# EAGLE design kolrs868_rx (EAGLE 6.4)
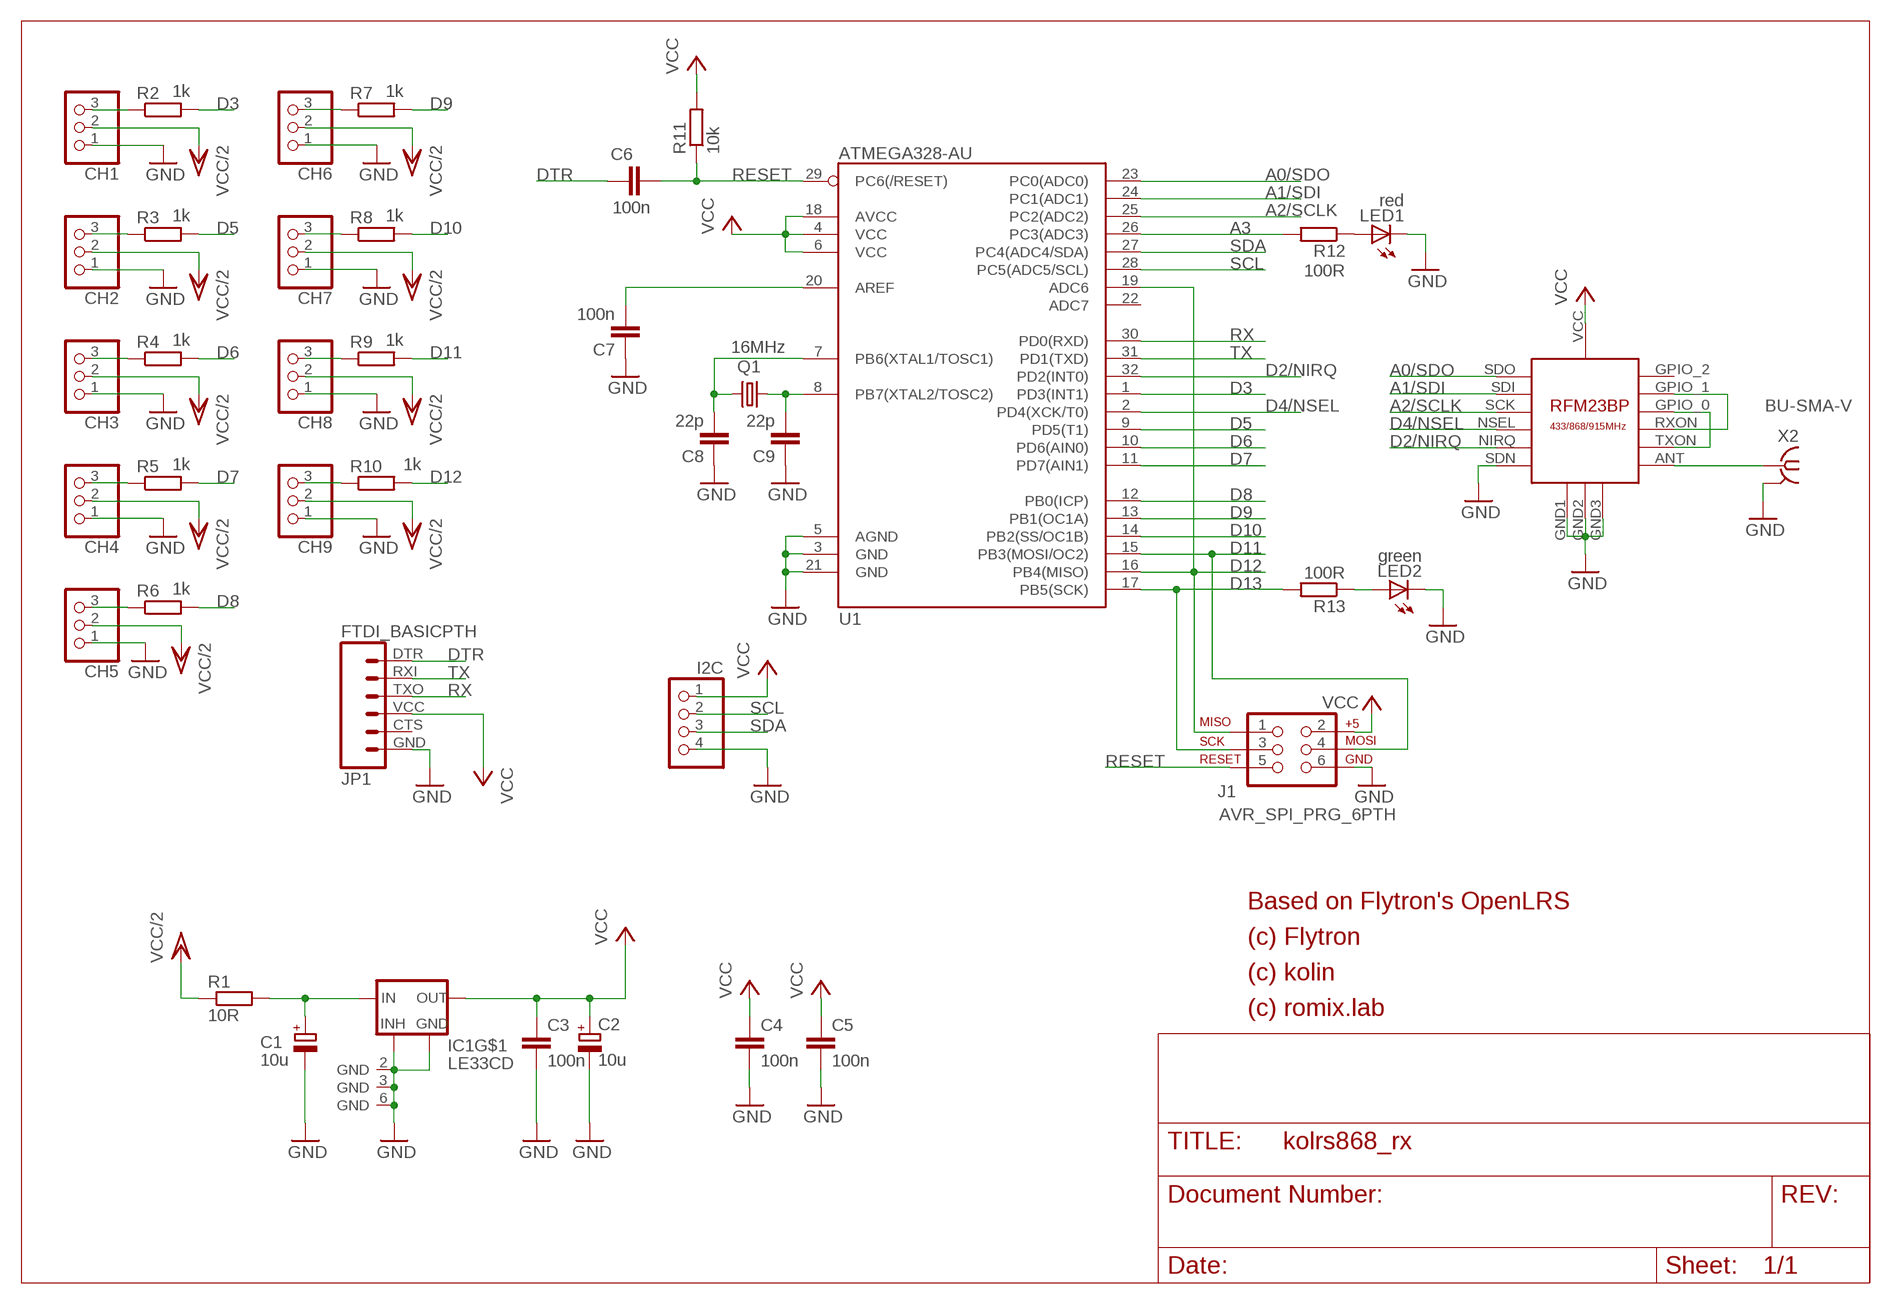
[diagram p0: schematic, sheet 1]

## Parts
C1  10u  CPOL-EUSMCB  [SMC_B]
C2  10u  CPOL-EUSMCB  [SMC_B]
C3  100n  C-EU_KOLIN  [M0805]
C4  100n  C-EU_KOLIN  [M0805]
C5  100n  C-EU_KOLIN  [M0805]
C6  100n  C-EU_KOLIN  [M0805]
C7  100n  C-EU_KOLIN  [M0805]
C8  22p  C-EU_KOLIN  [M0805]
C9  22p  C-EU_KOLIN  [M0805]
CH1  PINHD-1X3_KOLINOVO  [1X03]
CH2  PINHD-1X3_KOLINOVO  [1X03]
CH3  PINHD-1X3_KOLINOVO  [1X03]
CH4  PINHD-1X3_KOLINOVO  [1X03]
CH5  PINHD-1X3_KOLINOVO  [1X03]
CH6  PINHD-1X3_KOLINOVO  [1X03]
CH7  PINHD-1X3_KOLINOVO  [1X03]
CH8  PINHD-1X3_KOLINOVO  [1X03]
CH9  PINHD-1X3_KOLINOVO  [1X03]
I2C  PINHD-1X4  [1X04]
IC1  LE33CD  [SO8]
J1  AVR_SPI_PRG_6PTH  [2X3]
JP1  FTDI_BASICPTH  [FTDI_BASIC]
LED1  red  LEDCHIPLED_0805  [CHIPLED_0805]
LED2  green  LEDCHIPLED_0805  [CHIPLED_0805]
Q1  16MHz  CRYSTALHC49UP  [HC49UP]
R1  10R  R-EU_KOLINM0805  [M0805]
R2  1k  R-EU_KOLINM0805  [M0805]
R3  1k  R-EU_KOLINM0805  [M0805]
R4  1k  R-EU_KOLINM0805  [M0805]
R5  1k  R-EU_KOLINM0805  [M0805]
R6  1k  R-EU_KOLINM0805  [M0805]
R7  1k  R-EU_KOLINM0805  [M0805]
R8  1k  R-EU_KOLINM0805  [M0805]
R9  1k  R-EU_KOLINM0805  [M0805]
R10  1k  R-EU_KOLINM0805  [M0805]
R11  10k  R-EU_KOLINM0805  [M0805]
R12  100R  R-EU_KOLINM0805  [M0805]
R13  100R  R-EU_KOLINM0805  [M0805]
U1  ATMEGA328-AU  ATMEGA168  [TQFP32-08]
U$1  RFM23BP  [RFM23BP]
X2  BU-SMA-V  [BU-SMA-V]

## Nets
A0/SDO: U1.23(PC0(ADC0)) U$1.SDO
A1/SDI: U1.24(PC1(ADC1)) U$1.SDI
A2/SCLK: U1.25(PC2(ADC2)) U$1.SCK
A3: R12.2 U1.26(PC3(ADC3))
D2/NIRQ: U1.32(PD2(INT0)) U$1.NIRQ
D3: R2.2 U1.1(PD3(INT1))
D4/NSEL: U1.2(PD4(XCK/T0)) U$1.NSEL
D5: R3.2 U1.9(PD5(T1))
D6: R4.2 U1.10(PD6(AIN0))
D7: R5.2 U1.11(PD7(AIN1))
D8: R6.2 U1.12(PB0(ICP))
D9: R7.2 U1.13(PB1(OC1A))
D10: R8.2 U1.14(PB2(SS/OC1B))
D11: J1.4 R9.2 U1.15(PB3(MOSI/OC2))
D12: J1.1 R10.2 U1.16(PB4(MISO)) U1.19(ADC6)
D13: J1.3 R13.2 U1.17(PB5(SCK))
DTR: C6.1 JP1.DTR
GND: C1.- C2.- C3.2 C4.2 C5.2 C7.1 C8.1 C9.1 CH1.1 CH2.1 CH3.1 CH4.1 CH5.1 CH6.1 CH7.1 CH8.1 CH9.1 I2C.4 IC1.2(GND) IC1.3(GND) IC1.5(INHIBIT) IC1.6(GND) IC1.7(GND) J1.6 JP1.GND LED1.C LED2.C U1.3(GND) U1.5(AGND) U1.21(GND) U$1.GND1 U$1.GND2 U$1.GND3 U$1.SDN X2.2(GND)
N$1: C7.2 U1.20(AREF)
N$4: U$1.ANT X2.1
N$5: LED1.A R12.1
N$6: C8.2 Q1.2 U1.7(PB6(XTAL1/TOSC1))
N$7: C9.2 Q1.1 U1.8(PB7(XTAL2/TOSC2))
N$9: C1.+ IC1.8(IN) R1.2
N$11: CH5.3 R6.1
N$12: CH1.3 R2.1
N$14: CH2.3 R3.1
N$15: CH3.3 R4.1
N$16: CH4.3 R5.1
N$17: CH6.3 R7.1
N$18: CH7.3 R8.1
N$19: CH8.3 R9.1
N$20: CH9.3 R10.1
N$23: U$1.GPIO_0 U$1.TXON
N$24: U$1.GPIO_1 U$1.RXON
N$25: LED2.A R13.1
RESET: C6.2 J1.5 R11.1 U1.29(PC6(/RESET))
RX: JP1.TXO U1.30(PD0(RXD))
SCL: I2C.2 U1.28(PC5(ADC5/SCL))
SDA: I2C.3 U1.27(PC4(ADC4/SDA))
TX: JP1.RXI U1.31(PD1(TXD))
VCC: C2.+ C3.1 C4.1 C5.1 I2C.1 IC1.1(OUT) J1.2 JP1.VCC R11.2 U1.4(VCC) U1.6(VCC) U1.18(AVCC) U$1.VCC
VCC/2: CH1.2 CH2.2 CH3.2 CH4.2 CH5.2 CH6.2 CH7.2 CH8.2 CH9.2 R1.1
Unconnected: JP1.CTS U1.22(ADC7) U$1.GPIO_2

## Notes on the sheet
- Based on Flytron's OpenLRS
- (c) Flytron
- (c) kolin
- (c) romix.lab

## Power pins joined to a net without a drawn wire
GND: X2.3(GND) X2.4(GND) X2.5(GND)

## Library data of the parts
C1 C2 = rcl:CPOL-EU: POLARIZED CAPACITOR, European symbol
C3-C9 = PINHEAD_RC:C-EU_KOLIN: CAPACITOR, European symbol
CH1-CH9 = PINHEAD_RC:PINHD-1X3_KOLINOVO: KOLINOVO PIN HEADER
I2C = pinhead:PINHD-1X4: PIN HEADER
IC1 = libstabilizatory:LE33CD: VOLTAGE REGULATOR WITH INHIBIT
J1 = SparkFun:AVR_SPI_PRG_6: AVR ISP 6 Pin This is the reduced ISP connector for AVR programming. Common on Arduino. This footprint will take up less PCB space and can be used with a 10-pin to 6-pin adapter such as SKU: BOB-08508
JP1 = SparkFun:FTDI_BASIC: FTDI Basic: 3.3V and 5V
LED1 LED2 = led:LED: LED OSRAM: - CHIPLED LG R971, LG N971, LY N971, LG Q971, LY Q971, LO R971, LY R971 LH N974, LH R974 LS Q976, LO Q976, LY Q976 LO Q996 - Hyper CHIPLED LW Q18S LB Q993, LB Q99A, LB R99A - SideLED LS A670, LO A670, LY A670, LG A670, LP A670 LB A673, LV A673, LT A673, LW A673 LH A674 LY A675 LS A676, LA A676, LO A676, LY A676, LW A676 LS A679, LY A679, LG A679 - Hyper Micro SIDELED® LS Y876, LA Y876, LO Y876, LY Y876 LT Y87S - SmartLED LW L88C, LW L88S LB L89C, LB L89S, LG L890 LS L89K, LO L89K, LY L89K LS L896, LA L896, LO L896, LY L896 - TOPLED LS T670, LO T670, LY T670, LG T670, LP T670 LSG T670, LSP T670, LSY T670, LOP T670, LYG T670 LG T671, LOG T671, LSG T671 LB T673, LV T673, LT T673, LW T673 LH T674 LS T676, LA T676, LO T676, LY T676, LB T676, LH T676, LSB T676, LW T676 LB T67C, LV T67C, LT T67C, LS T67K, LO T67K, LY T67K, LW E67C LS E67B, LA E67B, LO E67B, LY E67B, LB E67C, LV E67C, LT E67C LW T67C LS T679, LY T679, LG T679 LS T770, LO T770, LY T770, LG T770, LP T770 LB T773, LV T773, LT T773, LW T773 LH T774 LS E675, LA E675, LY E675, LS T675 LS T776, LA T776, LO T776, LY T776, LB T776 LHGB T686 LT T68C, LB T68C - Hyper Mini TOPLED® LB M676 - Mini TOPLED Santana® LG M470 LS M47K, LO M47K, LY M47K Source: http://www.osram.convergy.de LUXEON: - LUMILED® LXK2-PW12-R00, LXK2-PW12-S00, LXK2-PW14-U00, LXK2-PW14-V00 LXK2-PM12-R00, LXK2-PM12-S00, LXK2-PM14-U00 LXK2-PE12-Q00, LXK2-PE12-R00, LXK2-PE12-S00, LXK2-PE14-T00, LXK2-PE14-U00 LXK2-PB12-K00, LXK2-PB12-L00, LXK2-PB12-M00, LXK2-PB14-N00, LXK2-PB14-P00, LXK2-PB14-Q00 LXK2-PR12-L00, LXK2-PR12-M00, LXK2-PR14-Q00, LXK2-PR14-R00 LXK2-PD12-Q00, LXK2-PD12-R00, LXK2-PD12-S00 LXK2-PH12-R00, LXK2-PH12-S00 LXK2-PL12-P00, LXK2-PL12-Q00, LXK2-PL12-R00 Source: www.luxeon.com KINGBRIGHT: KA-3528ASYC Source: www.kingbright.com
Q1 = crystal:CRYSTAL: CRYSTAL; OC_FARNELL: unknown; OC_NEWARK: unknown
R1-R13 = PINHEAD_RC:R-EU_KOLIN: RESISTOR, European symbol
U1 = SparkFun:ATMEGA168
U$1 = RFM23BP:RFM23BP: HopeRF RFM23BP Library by: http://projects.weber-itam.de
X2 = con-coax:BU-SMA-V: FEMALE SMA CONNECTOR Radiall distributor RS 112-3794; OC_FARNELL: unknown; OC_NEWARK: unknown

## Board
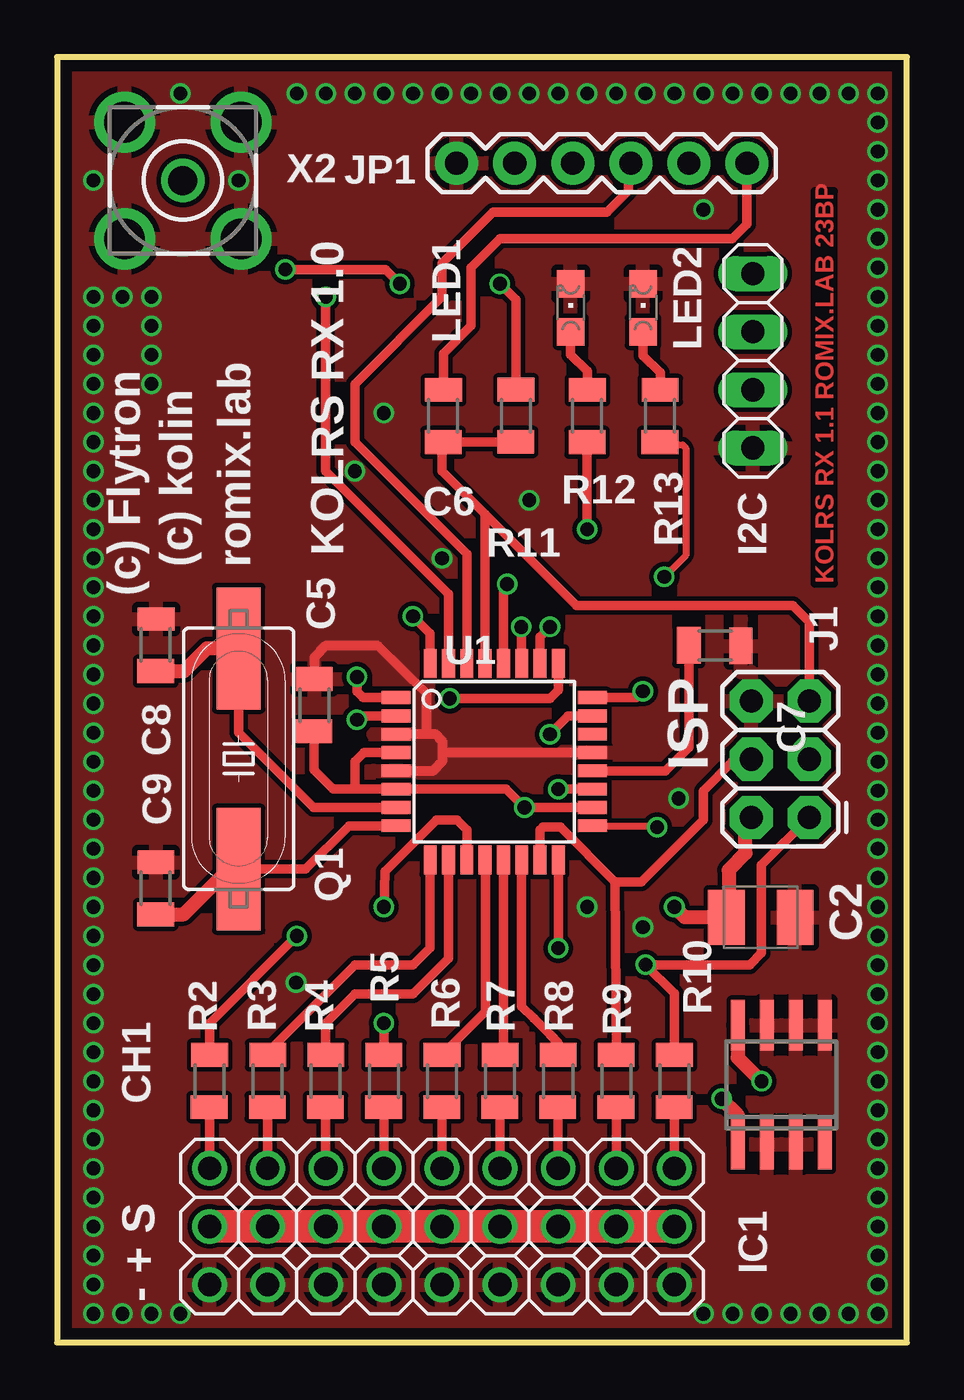
[diagram p1: board, top side]
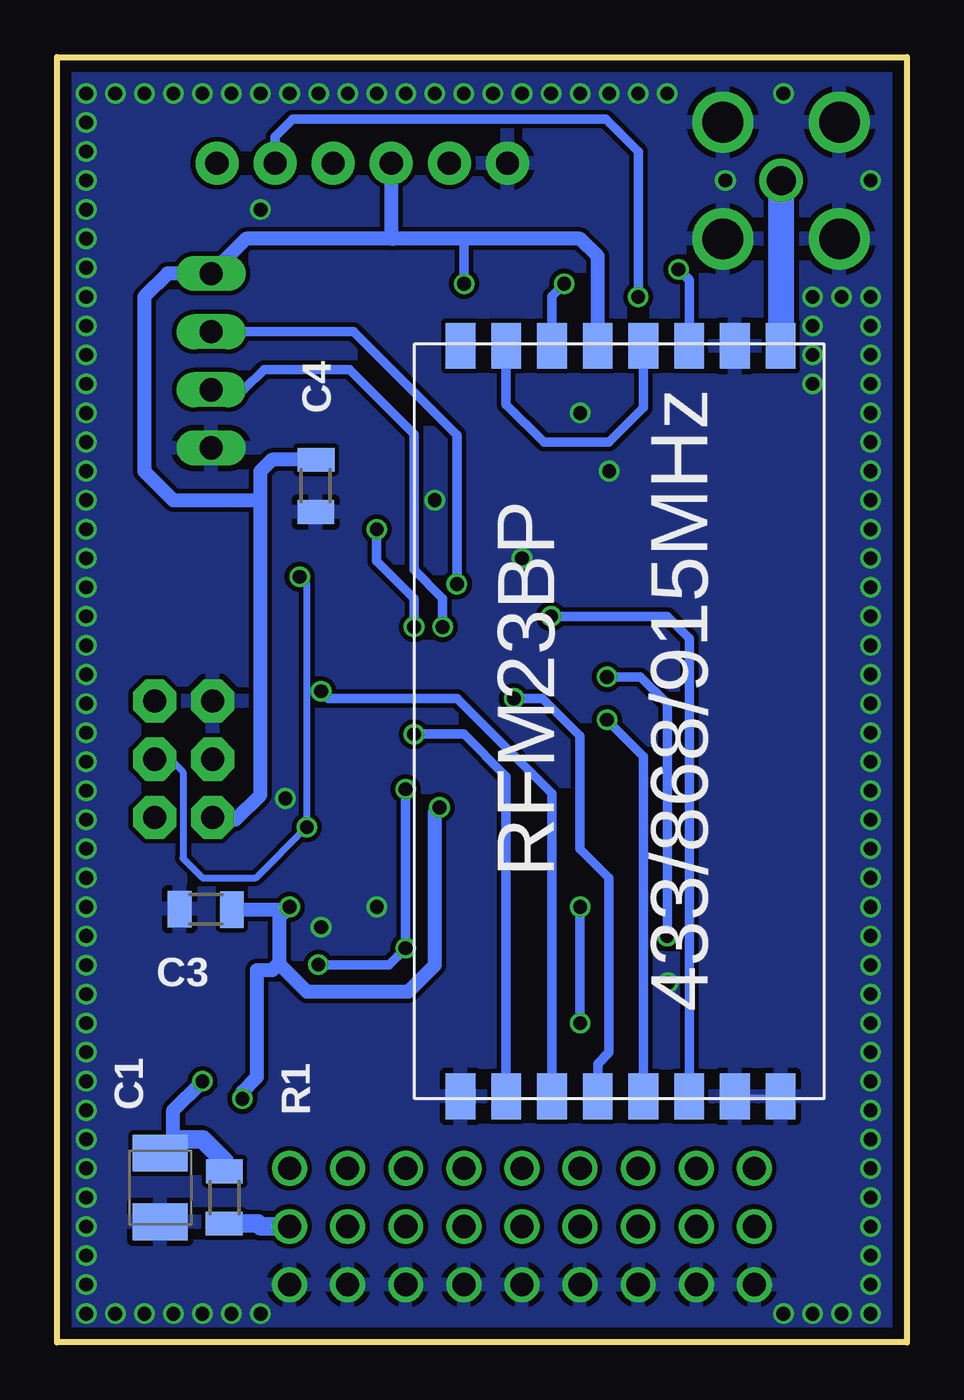
[diagram p2: board, bottom side, seen from below]

Size 37.14 x 56.17 mm. Coordinates in mm from the lower left corner, seen from the top.
Outline: 0,0 37.14,0 37.14,56.17 0,56.17 0,0
Copper layers (1*16): Top 0.018mm / dielectric 1.5mm / Bottom 0.018mm
Design rules "default": minimum track width 0.15mm, minimum drill 0.29mm, track to track 0.2mm, track to pad 0.2mm, pad to pad 0.2mm, via to via 0.2mm, smd to smd 0.2mm, copper to edge 20mil, drill to drill 8mil, minimum pad ring 0.15mm, minimum via ring 0.15mm, stop-mask expansion 4mil, vias tented up to drill 0.8mm, thermal gap 10mil

### Footprints (pad centres in the part's own frame; a part is rotated, then mirrored left to right if it is on the bottom)
SMC_B = smd 1.6 x 2.4: + -1.5,0; - 1.5,0
M0805 = smd 1.021 x 1.6: 1 -1.131,0.017 | smd 1.046 x 1.6: 2 1.148,0
1X03 = drill 1.016: 1 -2.54,0; 2 0,0; 3 2.54,0
1X04 = drill 1.016 long: 1 -3.81,0; 2 -1.27,0; 3 1.27,0; 4 3.81,0
SO8 = smd 0.6 x 2.2: 1 -1.905,-2.6; 2 -0.635,-2.6; 3 0.635,-2.6; 4 1.905,-2.6; 5 1.905,2.6; 6 0.635,2.6; 7 -0.635,2.6; 8 -1.905,2.6
2X3 = drill 1.016 pad 1.88 octagon: 1 0,0; 2 0,2.54; 3 2.54,0; 4 2.54,2.54; 5 5.08,0; 6 5.08,2.54
FTDI_BASIC = drill 1.016 pad 1.88: CTS 10.16,0; DTR 0,0; GND 12.7,0; RXI 2.54,0; TXO 5.08,0; VCC 7.62,0
CHIPLED_0805 = smd 1.2 x 1.2: A 0,-1.05; C 0,1.05
HC49UP = smd 5.334 x 1.93: 1 -4.826,0; 2 4.826,0
TQFP32-08 = smd 1.27 x 0.559: 1 -4.293,2.8; 2 -4.293,2; 3 -4.293,1.2; 4 -4.293,0.4; 5 -4.293,-0.4; 6 -4.293,-1.2; 7 -4.293,-2; 8 -4.293,-2.8; 17 4.293,-2.8; 18 4.293,-2; 19 4.293,-1.2; 20 4.293,-0.4; 21 4.293,0.4; 22 4.293,1.2; 23 4.293,2; 24 4.293,2.8 | smd 0.559 x 1.27: 9 -2.8,-4.293; 10 -2,-4.293; 11 -1.2,-4.293; 12 -0.4,-4.293; 13 0.4,-4.293; 14 1.2,-4.293; 15 2,-4.293; 16 2.8,-4.293; 25 2.8,4.293; 26 2,4.293; 27 1.2,4.293; 28 0.4,4.293; 29 -0.4,4.293; 30 -1.2,4.293; 31 -2,4.293; 32 -2.8,4.293
RFM23BP = smd 2 x 1.3: ANT 16.9,-7.5; GND1 -15.9,6.5; GND2 -15.9,-7.5; GND3 16.9,-5.5; GPIO_0 16.9,2.5; GPIO_1 16.9,4.5; GPIO_2 16.9,6.5; NIRQ -15.9,-3.5; NSEL -15.9,-1.5; RXON 16.9,-1.5; SCK -15.9,0.5; SDI -15.9,2.5; SDN -15.9,-5.5; SDO -15.9,4.5; TXON 16.9,-3.5; VCC 16.9,0.5
BU-SMA-V = drill 1.27: 1 0,0 | drill 1.778: 2 -2.55,2.55; 3 2.55,2.55; 4 2.55,-2.55; 5 -2.55,-2.55

### Placement (x,y rotation side)
C1  32.63,6.76 270 bottom
C2  30.75,18.58 0 top
C3  30.63,18.93 180 bottom
C4  25.84,37.45 270 bottom
C5  11.24,27.84 90 top
C6  16.87,40.49 270 top
C7  28.76,30.46 180 top
C8  4.31,30.48 270 top
C9  4.31,19.85 270 top
CH1  6.66,5.06 90 top
CH2  9.2,5.06 90 top
CH3  11.74,5.06 90 top
CH4  14.28,5.06 90 top
CH5  16.82,5.06 90 top
CH6  19.36,5.06 90 top
CH7  21.9,5.06 90 top
CH8  24.44,5.06 90 top
CH9  26.98,5.06 90 top
I2C  30.41,42.91 270 top
IC1  31.66,11.26 0 top
J1  32.88,22.95 90 top
JP1  30.16,51.54 180 top
LED1  22.45,45.22 0 top
LED2  25.61,45.22 0 top
Q1  7.93,25.51 90 top
R1  29.83,6.33 90 bottom
R2  6.66,11.41 90 top
R3  9.2,11.41 90 top
R4  11.74,11.41 90 top
R5  14.28,11.41 90 top
R6  16.82,11.41 90 top
R7  19.36,11.41 90 top
R8  21.9,11.41 90 top
R9  24.44,11.41 90 top
R10  26.98,11.41 90 top
R11  20.06,40.49 90 top
R12  23.16,40.49 270 top
R13  26.35,40.49 270 top
U1  19.11,25.38 0 top
U$1  13.01,26.65 90 bottom
X2  5.49,50.78 0 top

### Tracks (layer width: path | path; a pad name or v marks a point on that pad's centre or on a via)
A0/SDO  (via drill 0.6)
  Top 0.406: U1.23 22.34,27.38 v21.54,26.58
  Bottom 0.406: U$1.SDO 17.51,24.74 19.35,26.58 v21.54,26.58
A1/SDI  (via drill 0.6)
  Top 0.406: U1.24 25.33,28.18 v25.6,28.46
  Bottom 0.406: U$1.SDI 15.51,23.99 19.67,28.14 25.29,28.14 v25.6,28.46
A2/SCLK  (via drill 0.6)
  Top 0.406: U1.25 21.91,28.51 21.54,28.14 v17.17,28.14
  Bottom 0.406: U$1.SCK 13.51,12.18 13.01,12.68 13.01,20.3 14.28,21.57 14.28,26.51 15.92,28.14 v17.17,28.14
A3  (via drill 0.6)
  Top 0.406: U1.26 21.11,30.84 v21.54,31.27 | R12.2 v23.16,35.55 v23.17,35.54
  Bottom 0.406: v21.54,31.27 21.54,32.52 23.17,34.15 v23.17,35.54
D2/NIRQ  (via drill 0.6)
  Top 0.406: U1.32 16.31,30.97 v15.55,31.73
  Bottom 0.406: v15.55,31.73 10.47,31.73 9.51,30.77 U$1.NIRQ
D3  (via drill 0.6)
  Top 0.406: U1.1 13.38,28.18 13.1,28.46 v13.1,29.08 | v10.47,17.76 6.66,13.95 R2.2
  Bottom 0.406: v13.1,29.08 11.63,29.08 10.47,27.92 v10.47,17.76
D4/NSEL  (via drill 0.6)
  Top 0.406: U1.2 13.28,27.38 v13.1,27.21
  Bottom 0.406: v13.1,27.21 11.51,25.61 U$1.NSEL
D5
  Top 0.406: U1.9 16.31,17.25 15.55,16.49 13.01,16.49 9.2,12.68 R3.2
D6
  Top 0.406: U1.10 17.11,16.78 15.55,15.22 13.01,15.22 11.74,13.95 R4.2
D7  (via drill 0.6)
  Top 0.406: R5.2 v14.28,13.95 | v14.28,19.03 14.33,20.57 16.59,22.83 17.48,22.83 17.91,22.4 U1.11
  Bottom 0.406: v14.28,13.95 v14.28,19.03
D8
  Top 0.406: U1.12 18.73,21.09 18.73,14.47 R6.2
D9
  Top 0.406: R7.2 19.51,12.56 U1.13
D10
  Top 0.406: U1.14 20.31,14.69 20.84,14.16 21.54,13.46 21.9,13.1 R8.2
D11
  Top 0.406: U1.15 21.11,22.4 21.23,22.52 21.99,22.52 24.39,20.12 | R9.2 24.39,20.12 | 24.39,20.12 25.53,20.12 28.25,22.84 28.25,24.11 29.52,25.38 30.24,25.38 J1.4
D12  (via drill 0.6 pad 0.59)
  Top 0.406: J1.1 30.79,20.86 30.79,17.02 30.28,16.5 v25.72,16.5 26.98,15.25 R10.2 | v21.91,17.23 U1.16 | v21.91,24.18 U1.19
  Bottom 0.406: v25.72,16.5 22.63,16.5 22.27,16.86 v21.91,17.23 v21.91,24.18
D13  (via drill 0.6)
  Top 0.305: U1.17 26.17,22.58 v26.23,22.52 | R13.2 27.34,39.22 27.48,39.08 27.48,34.4 v26.54,33.46
  Bottom 0.305: J1.3 32.21,25.49 31.64,24.92 31.64,21.15 30.79,20.3 28.45,20.3 v26.23,22.52 26.23,33.15 v26.54,33.46
DTR
  Top 0.406: C6.1 16.89,43.23 18.09,44.43 18.09,46.97 19.36,48.24 29.52,48.24 30.16,48.88 JP1.DTR
GND  (via drill 0.6)
  Top 0.406: U1.5 16.42,24.98 16.85,25.41 16.85,25.64 | U1.3 16.14,26.58 | 16.14,26.58 16.55,26.58 16.85,26.27 16.85,25.64 | U1.21 16.99,25.78 16.85,25.64 | 16.14,26.58 16.14,28.37 14,30.46 11.74,30.46 11.24,29.96 C5.2
  Bottom 0.15: U$1.GND2 U$1.SDN
  other vias: 5.39,54.59 1.58,50.78 10.47,54.59 1.58,45.7 27.17,23.77 20.63,36.81 35.87,1.25 34.6,1.25 33.33,1.25 32.06,1.25 30.79,1.25 29.52,1.25 35.87,3.79 35.87,5.06 35.87,6.33 35.87,54.59 35.87,53.32 11.74,54.59 13.01,54.59 14.28,54.59 15.55,54.59 16.82,54.59 18.09,54.59 19.36,54.59 20.63,54.59 21.9,54.59 23.17,54.59 24.44,54.59 25.71,54.59 26.98,54.59 28.25,54.59 29.52,54.59 30.79,54.59 32.06,54.59 33.33,54.59 34.6,54.59 7.93,50.78 35.87,52.05 35.87,50.78 35.87,49.51 35.87,48.24 35.87,46.97 35.87,45.7 35.87,44.43 35.87,43.16 35.87,41.89 35.87,40.62 35.87,39.35 35.87,38.08 35.87,36.81 35.87,35.54 35.87,34.27 35.87,33 35.87,31.73 35.87,30.46 35.87,29.19 35.87,26.65 35.87,27.92 35.87,25.38 35.87,24.11 35.87,22.84 35.87,21.57 35.87,20.3 35.87,19.03 35.87,17.76 35.87,16.49 35.87,15.22 35.87,13.95 35.87,12.68 35.87,11.41 35.87,10.14 35.87,8.87 35.87,7.6 35.87,2.52 4.12,1.25 2.85,1.25 1.58,44.43 1.58,43.16 1.58,41.89 1.58,40.62 1.58,39.35 1.58,38.08 1.58,36.81 1.58,35.54 1.58,34.27 1.58,33 1.58,31.73 1.58,30.46 1.58,29.19 1.58,27.92 1.58,25.38 1.58,26.65 1.58,20.3 1.58,19.03 1.58,17.76 1.58,24.11 1.58,22.84 1.58,21.57 1.58,16.49 1.58,15.22 1.58,13.95 1.58,12.68 1.58,11.41 1.58,10.14 1.58,8.87 1.58,7.6 1.58,6.33 1.58,5.06 1.58,3.79 1.58,2.52 1.58,1.25 2.85,45.7 4.12,45.7 4.12,44.43 4.12,43.16 4.12,41.89 13.01,38.08 16.82,34.27 14.28,40.62 23.17,19.03 25.61,18.14 5.39,1.25 28.25,1.25 28.25,49.51 10.44,15.72
  pour Bottom: -0.96,57.13 38.41,57.13 38.41,-1.29 -0.96,-1.29
  pour Top: -0.96,57.13 38.41,57.13 38.41,-1.29 -0.96,-1.29
N$1
  Top 0.406: U1.20 26.58,24.98 27.61,26.01 C7.2
N$4
  Bottom 1.143: U$1.ANT arc-90 5.49,43.57 X2.1
N$5
  Top 0.406: LED1.A 22.45,43.18 23.18,42.45 R12.1
N$6
  Top 0.406: U1.7 11.2,23.38 7.93,26.65 Q1.2
  Top 0.61: C8.2 5.54,29.34 6.54,30.33 Q1.2
N$7
  Top 0.406: Q1.1 10.85,20.68 12.75,22.58 U1.8
  Top 0.61: C9.2 5.54,18.7 7.52,20.68 Q1.1
N$9  (via drill 0.6)
  Top 0.61: v30.79,11.41 30.78,11.41 29.75,12.43 IC1.8
  Bottom 0.61: 30.79,8.87 32.06,8.87 32.06,10.14 v30.79,11.41
  Bottom 0.813: R1.2 29.83,7.9 30.79,8.87 32.03,8.87 C1.+
N$11
  Top 0.406: R6.1 16.82,10.28 CH5.3
N$12
  Top 0.406: R2.1 6.66,10.28 CH1.3
N$14
  Top 0.406: R3.1 9.2,10.28 CH2.3
N$15
  Top 0.406: R4.1 11.74,10.28 CH3.3
N$16
  Top 0.406: R5.1 14.28,10.28 CH4.3
N$17
  Top 0.406: R7.1 19.36,10.28 CH6.3
N$18
  Top 0.406: R8.1 21.9,10.28 CH7.3
N$19
  Top 0.406: R9.1 24.44,10.28 CH8.3
N$20
  Top 0.406: R10.1 26.98,10.28 CH9.3
N$23  (via drill 0.6)
  Top 0.406: v14.98,46.27 14.35,46.9 v9.98,46.9
  Bottom 0.406: U$1.GPIO_0 15.51,45.74 v14.98,46.27 | U$1.TXON 9.51,46.43 v9.98,46.9
N$24
  Bottom 0.406: U$1.RXON 11.51,40.85 13.01,39.35 15.87,39.35 17.51,40.99 U$1.GPIO_1
N$25
  Top 0.406: LED2.A 25.61,43.14 26.37,42.38 R13.1
RESET
  Top 0.406: U1.29 18.71,36.19 | 18.71,36.19 16.82,38.08 16.82,39.3 C6.2 20.02,39.35 R11.1 | J1.5 32.88,31.49 32.17,32.21 22.69,32.21 18.71,36.19
RX
  Top 0.406: U1.30 17.91,34.45 13.01,39.35 13.01,41.89 16.82,45.7 16.82,47.18 19.04,49.4 24.04,49.4 24.98,50.33 24.98,51.45 JP1.TXO
SCL  (via drill 0.6)
  Top 0.406: U1.28 19.51,32.99 v19.67,33.15
  Bottom 0.406: I2C.2 24.19,44.18 19.67,39.66 v19.67,33.15
SDA  (via drill 0.6)
  Top 0.406: U1.27 20.31,31.25 v20.29,31.27
  Bottom 0.406: I2C.3 28.99,41.64 28.1,42.52 24.35,42.52 21.54,39.71 21.54,33.77 20.29,32.52 v20.29,31.27
TX  (via drill 0.6)
  Top 0.406: U1.31 17.11,32.71 11.74,38.08 v11.74,45.7
  Bottom 0.406: JP1.RXI 27.62,52.7 26.85,53.46 13.15,53.46 11.74,52.05 v11.74,45.7
VCC  (via drill 0.6, 0.6 pad 0.59)
  Top 0.406: U1.18 v20.43,23.38 19.63,24.18 U1.6 13.01,24.18 | C5.1 11.23,25.02 12.07,24.18 13.01,24.18 | U1.4 13.41,25.78 13.01,25.38 13.01,24.18 | R11.2 20.06,45.57 v19.35,46.27
  Top 0.61: IC1.1 29.75,9.93 v29.04,10.64 | v26.98,19.03 27.43,18.58 C2.+ 29.35,18.68 29.35,20.64 30.09,21.38 30.09,22.7 J1.2
  Bottom 0.406: v19.35,46.27 19.35,48.23 19.36,48.24
  Bottom 0.61: v29.04,10.64 29.04,10.96 28.42,11.58 28.42,16.27 27.75,16.27 27.43,16.58 | 29.39,19.03 C3.1 27.1,18.92 v26.98,19.03 27.43,18.58 27.43,16.58 | 27.43,16.58 27.43,16.54 26.23,15.33 21.79,15.33 20.63,16.49 20.63,23.18 v20.43,23.38 | 28.25,36.81 28.25,23.93 29.35,22.83 30.23,22.83 J1.2 | 28.25,36.81 28.25,38.08 27.76,38.58 C4.1 | 28.25,36.81 32.06,36.81 33.33,38.08 33.33,45.7 32.32,46.72 I2C.1 28.89,48.24 22.48,48.24 | U$1.VCC 13.51,47.47 14.28,48.24 19.36,48.24 22.48,48.24 | JP1.VCC 22.54,48.3 22.48,48.24
VCC/2
  Top 1.422: CH1.2 CH2.2 CH3.2 CH4.2 CH5.2 CH6.2 CH7.2 CH8.2 CH9.2
  Bottom 0.813: R1.1 28.39,5.19 28.25,5.06 CH9.2

### Text on the board
Top: KOLRS RX 1.1 ROMIX.LAB 23BP
tNames: KOLRS RX 1.0 | (c) kolin | romix.lab | (c) Flytron | ISP | - + S